# EAGLE design board (EAGLE 9.6.1)
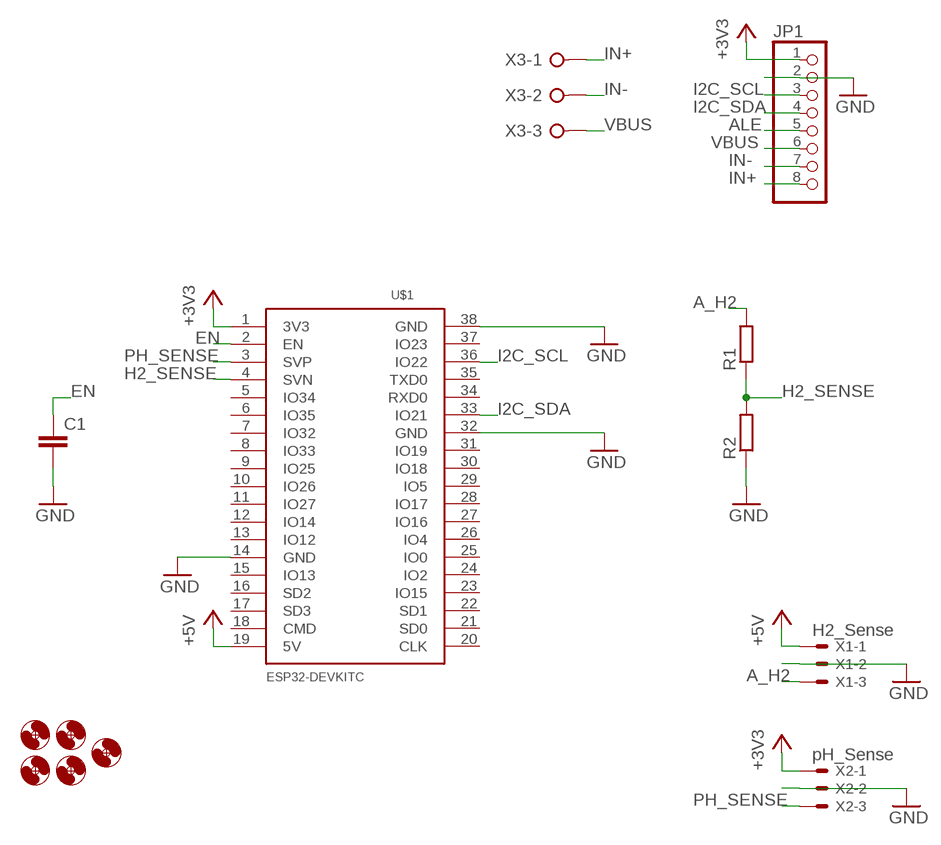
[diagram p0: schematic, sheet 1]

## Parts
C1  C-EUC0805  [C0805]
H1  MOUNT-HOLE3.0  [3,0]
H2  MOUNT-HOLE3.0  [3,0]
H3  MOUNT-HOLE3.0  [3,0]
H4  MOUNT-HOLE3.0  [3,0]
H6  MOUNT-HOLE3.0  [3,0]
JP1  PINHD-1X8  [1X08]
R1  R-EU_R0805  [R0805]
R2  R-EU_R0805  [R0805]
U$1  ESP32DEVKITC  [ESP32-DEVKITC]
X1  H2_Sense  JST-XH-03-PIN-LONG-PAD  [JST-XH-03-PACKAGE-LONG-PAD]
X2  pH_Sense  JST-XH-03-PIN-LONG-PAD  [JST-XH-03-PACKAGE-LONG-PAD]
X3  W237-3E  [W237-3E]

## Nets
+3V3: JP1.1 U$1.1(3V3) X2.1
+5V: U$1.19(5V) X1.1
A_H2: R1.2 X1.3
ALE: JP1.5
EN: C1.1 U$1.2(EN)
GND: C1.2 JP1.2 R2.1 U$1.14(GND) U$1.32(GND) U$1.38(GND) X1.2 X2.2
H2_SENSE: R1.1 R2.2 U$1.4(SVN)
I2C_SCL: JP1.3 U$1.36(IO22)
I2C_SDA: JP1.4 U$1.33(IO21)
IN+: JP1.8 X3.1
IN-: JP1.7 X3.2
PH_SENSE: U$1.3(SVP) X2.3
VBUS: JP1.6 X3.3
Unconnected: U$1.5(IO34) U$1.6(IO35) U$1.7(IO32) U$1.8(IO33) U$1.9(IO25) U$1.10(IO26) U$1.11(IO27) U$1.12(IO14) U$1.13(IO12) U$1.15(IO13) U$1.16(SD2) U$1.17(SD3) U$1.18(CMD) U$1.20(CLK) U$1.21(SD0) U$1.22(SD1) U$1.23(IO15) U$1.24(IO2) U$1.25(IO0) U$1.26(IO4) U$1.27(IO16) U$1.28(IO17) U$1.29(IO5) U$1.30(IO18) U$1.31(IO19) U$1.34(RXD0) U$1.35(TXD0) U$1.37(IO23)

## Library data of the parts
C1 = rcl:C-EU: CAPACITOR, European symbol; SPICEPREFIX: C
H1-H4 H6 = holes:MOUNT-HOLE: MOUNTING HOLE with drill center marker
JP1 = pinhead:PINHD-1X8: PIN HEADER
R1 R2 = rcl:R-EU_: RESISTOR, European symbol; SPICEPREFIX: R
U$1 = ESP32-DEVKITC:ESP32DEVKITC
X1 X2 = Rembrandt Electronics - JST XH Connectors v1-0-2-2-2-2:JST-XH-03-PIN: JST XH Connector 2 Pin Wire to board connector. Pitch: 2,54 mm, (0.100") Number of pins: 3 Created by Rembrandt Electronics www.rembrandtelectronics.com
X3 = con-wago-508:W237-3E: WAGO SREW CLAMP; OC_FARNELL: unknown; OC_NEWARK: unknown

## Board
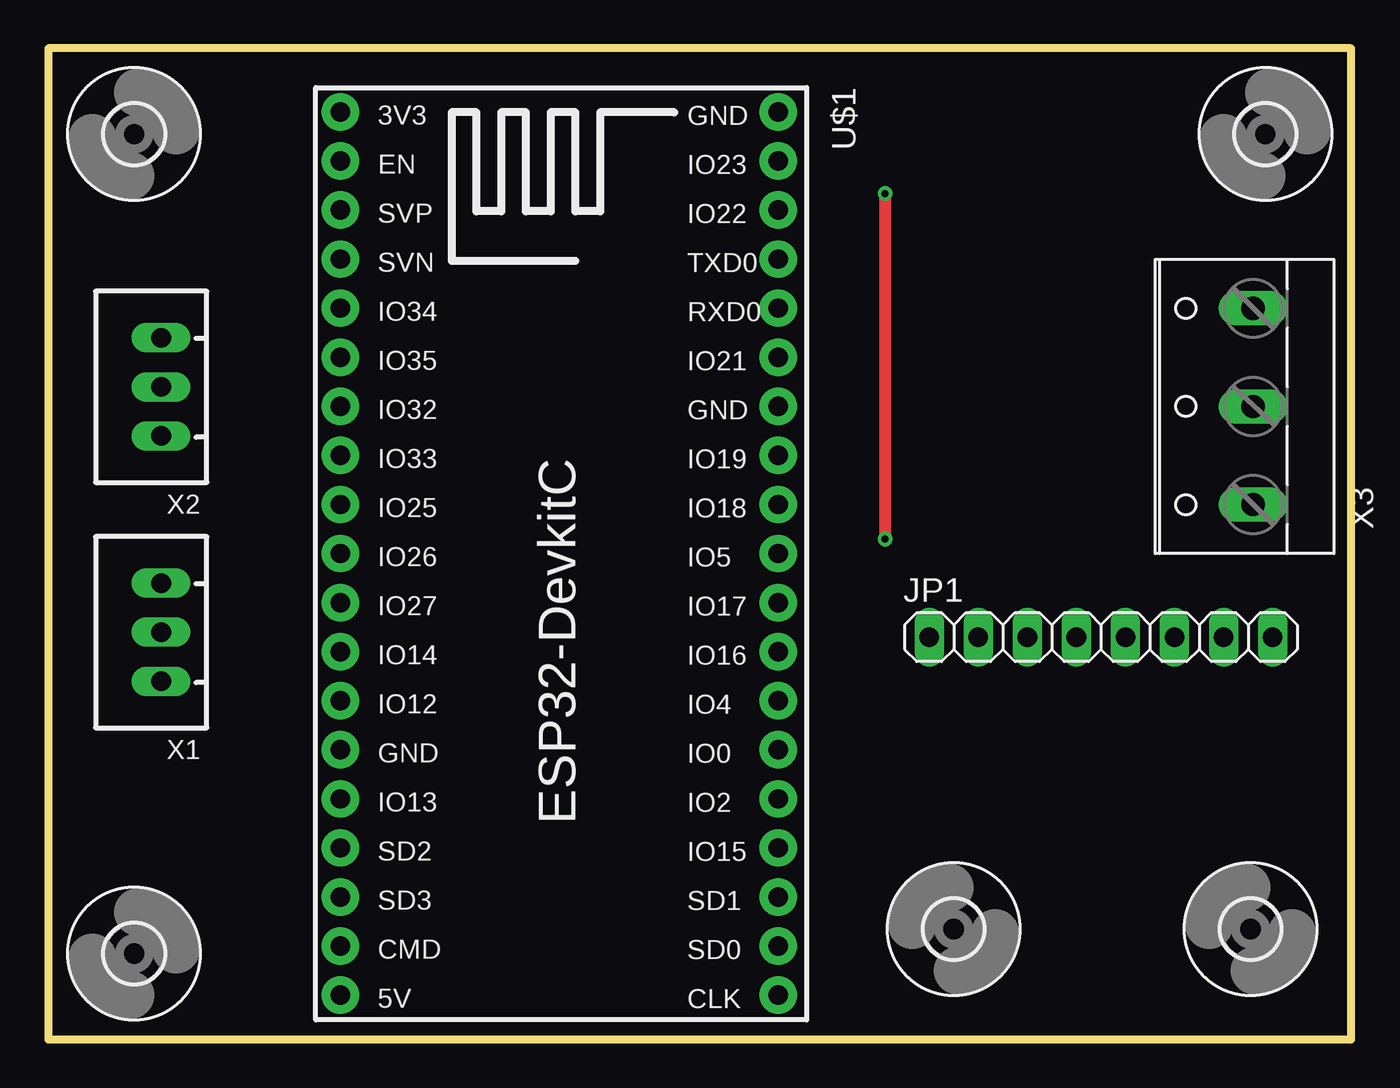
[diagram p1: board, top side]
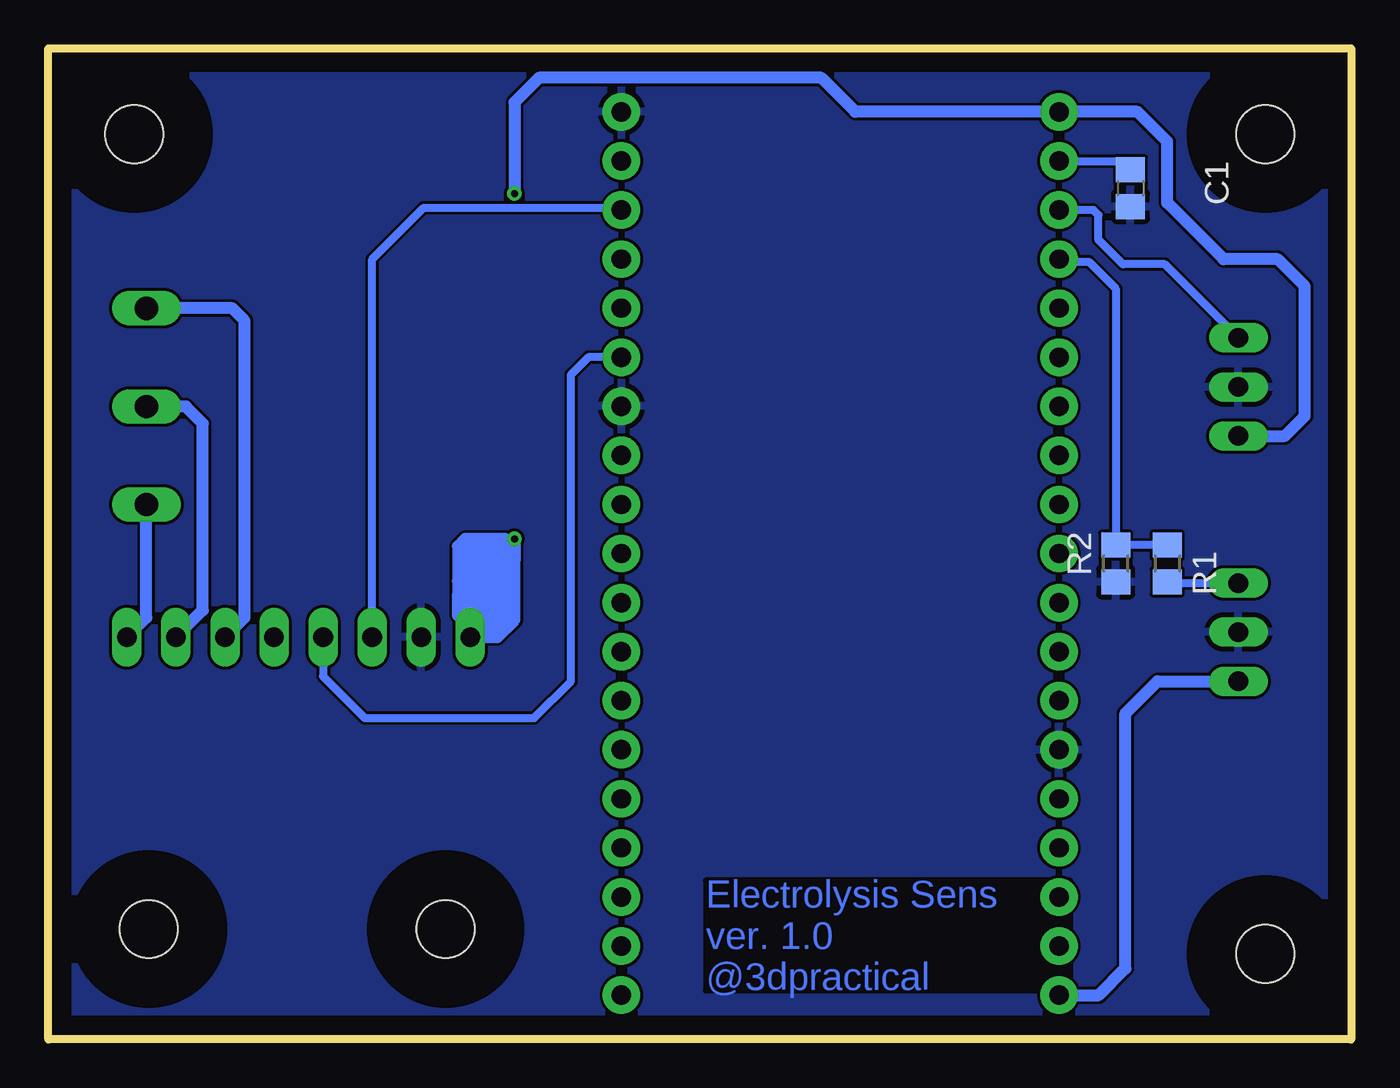
[diagram p2: board, bottom side, seen from below]

Size 67.44 x 51.31 mm. Coordinates in mm from the lower left corner, seen from the top.
Outline: 0,0 67.44,0 67.44,51.31 0,51.31 0,0
Copper layers (1*16): Top 0.035mm / dielectric 1.5mm / Bottom 0.035mm
Design rules "default": minimum track width 6mil, minimum drill 0.35mm, track to track 6mil, track to pad 6mil, pad to pad 6mil, via to via 6mil, smd to smd 6mil, copper to edge 40mil, drill to drill 6mil, minimum pad ring 10mil, minimum via ring 8mil, stop-mask expansion 4mil, vias tented up to drill 0mil, thermal gap 10mil

### Footprints (pad centres in the part's own frame; a part is rotated, then mirrored left to right if it is on the bottom)
C0805 = smd 1.3 x 1.5: 1 -0.95,0; 2 0.95,0
3,0 = hole 3: 0,0
1X08 = drill 1.016 long: 1 -8.89,0; 2 -6.35,0; 3 -3.81,0; 4 -1.27,0; 5 1.27,0; 6 3.81,0; 7 6.35,0; 8 8.89,0
R0805 = smd 1.3 x 1.5: 1 -0.95,0; 2 0.95,0
ESP32-DEVKITC = drill 1 pad 1.93: 1 -22.87,-11.42; 2 -20.33,-11.42; 3 -17.79,-11.42; 4 -15.25,-11.42; 5 -12.71,-11.42; 6 -10.17,-11.42; 7 -7.63,-11.42; 8 -5.09,-11.42; 9 -2.55,-11.42; 10 -0.01,-11.42; 11 2.53,-11.42; 12 5.07,-11.42; 13 7.61,-11.42; 14 10.15,-11.42; 15 12.69,-11.42; 16 15.23,-11.42; 17 17.77,-11.42; 18 20.31,-11.42; 19 22.85,-11.42; 20 22.85,11.23; 21 20.31,11.23; 22 17.77,11.23; 23 15.23,11.23; 24 12.69,11.23; 25 10.15,11.23; 26 7.61,11.23; 27 5.07,11.23; 28 2.53,11.23; 29 -0.01,11.23; 30 -2.55,11.23; 31 -5.09,11.23; 32 -7.63,11.23; 33 -10.17,11.23; 34 -12.71,11.23; 35 -15.25,11.23; 36 -17.79,11.23; 37 -20.33,11.23; 38 -22.87,11.23
JST-XH-03-PACKAGE-LONG-PAD = drill 1.016 long: 1 -2.54,0; 2 0,0; 3 2.54,0
W237-3E = drill 1.194 long: 1 -5.08,-0.635; 2 0,-0.635; 3 5.08,-0.635

### Placement (x,y rotation side)
C1  11.43,44.07 270 bottom
H1  62.23,5.71 270 top
H2  46.86,5.71 270 top
H3  4.45,46.86 0 top
H4  4.45,4.45 0 top
H6  62.99,46.86 0 top
JP1  54.48,20.83 0 top
R1  9.52,24.64 270 bottom
R2  12.19,24.64 90 bottom
U$1  26.54,25.15 270 top
X1  5.84,21.08 90 top
X2  5.84,33.78 90 top
X3  61.72,32.77 90 top

### Tracks (layer width: path | path; a pad name or v marks a point on that pad's centre or on a via)
+3V3  (via drill 0.35)
  Top 0.61: v43.31,43.79 v43.31,25.91
  Bottom 0.61: X2.1 3.43,31.24 2.41,32.26 2.41,38.99 3.81,40.39 6.6,40.39 9.52,43.31 9.52,46.48 11.06,48.02 U$1.1 25.66,48.02 27.43,49.78 42.04,49.78 43.31,48.51 v43.31,43.79 | JP1.1 44.2,20.83 43.31,21.72 43.31,24.77 | 43.31,24.77 43.69,25.15 | 43.69,25.15 44.32,25.78 45.59,25.78 | 45.59,25.78 45.97,25.78 | 46.23,25.53 45.97,25.78 | 46.23,25.53 46.23,23.75 | 46.23,22.99 46.23,21.97 45.59,21.34 JP1.1 | JP1.1 45.59,22.35 | 45.59,22.35 45.59,24.89 | 45.59,24.89 45.21,25.27 44.45,25.27 43.81,24.64 43.81,21.97 44.45,21.34 45.09,21.34 45.09,24.77 44.7,24.77 | 44.7,24.77 44.32,24.77 44.32,22.1 44.7,21.72 | 45.97,25.78 45.85,25.91 43.81,25.91 43.69,25.78 43.69,25.15 | 46.23,25.53 45.59,24.89 | 45.59,24.89 45.59,25.78 | v43.31,25.91 43.31,24.77 | 45.97,25.78 45.97,24 | 45.97,24 46.23,23.75 | 46.23,23.75 46.23,22.99 | 46.23,22.99 45.85,22.61 | 45.85,22.61 45.59,22.35 | 45.85,22.61 45.85,23.88 45.97,24 | JP1.1 44.7,21.72 | 44.7,21.72 44.7,24.77
+5V
  Bottom 0.61: U$1.19 13.07,2.3 11.68,3.68 11.68,16.89 10.03,18.54 X1.1
A_H2
  Bottom 0.406: R1.2 9.46,23.62 X1.3
EN
  Bottom 0.406: U$1.2 11.89,45.48 C1.1
GND
  pour Bottom: 0,51.31 0,0 67.44,0 67.44,51.31
H2_SENSE
  Bottom 0.406: R1.1 R2.2 12.19,38.86 13.59,40.26 14.99,40.26 U$1.4
I2C_SCL
  Bottom 0.406: JP1.3 50.67,40.39 48.01,43.05 37.89,43.05 U$1.36
I2C_SDA
  Bottom 0.406: U$1.33 39.49,35.32 40.39,34.42 40.39,18.54 42.29,16.64 51.05,16.64 53.21,18.8 JP1.4
IN+
  Bottom 0.61: JP1.8 62.36,21.84 X3.1
IN-
  Bottom 0.61: JP1.7 59.44,22.23 59.44,31.88 60.33,32.77 X3.2
PH_SENSE
  Bottom 0.406: X2.3 9.65,40.13 11.81,40.13 13.08,41.4 13.08,42.67 13.34,42.94 U$1.3
VBUS
  Bottom 0.61: JP1.6 57.28,21.84 57.28,37.21 57.91,37.85 X3.3

### Text on the board
Bottom: Electrolysis Sens / ver. 1.0 / @3dpractical